# EAGLE design V6523_v2 (EAGLE 7.7.0)
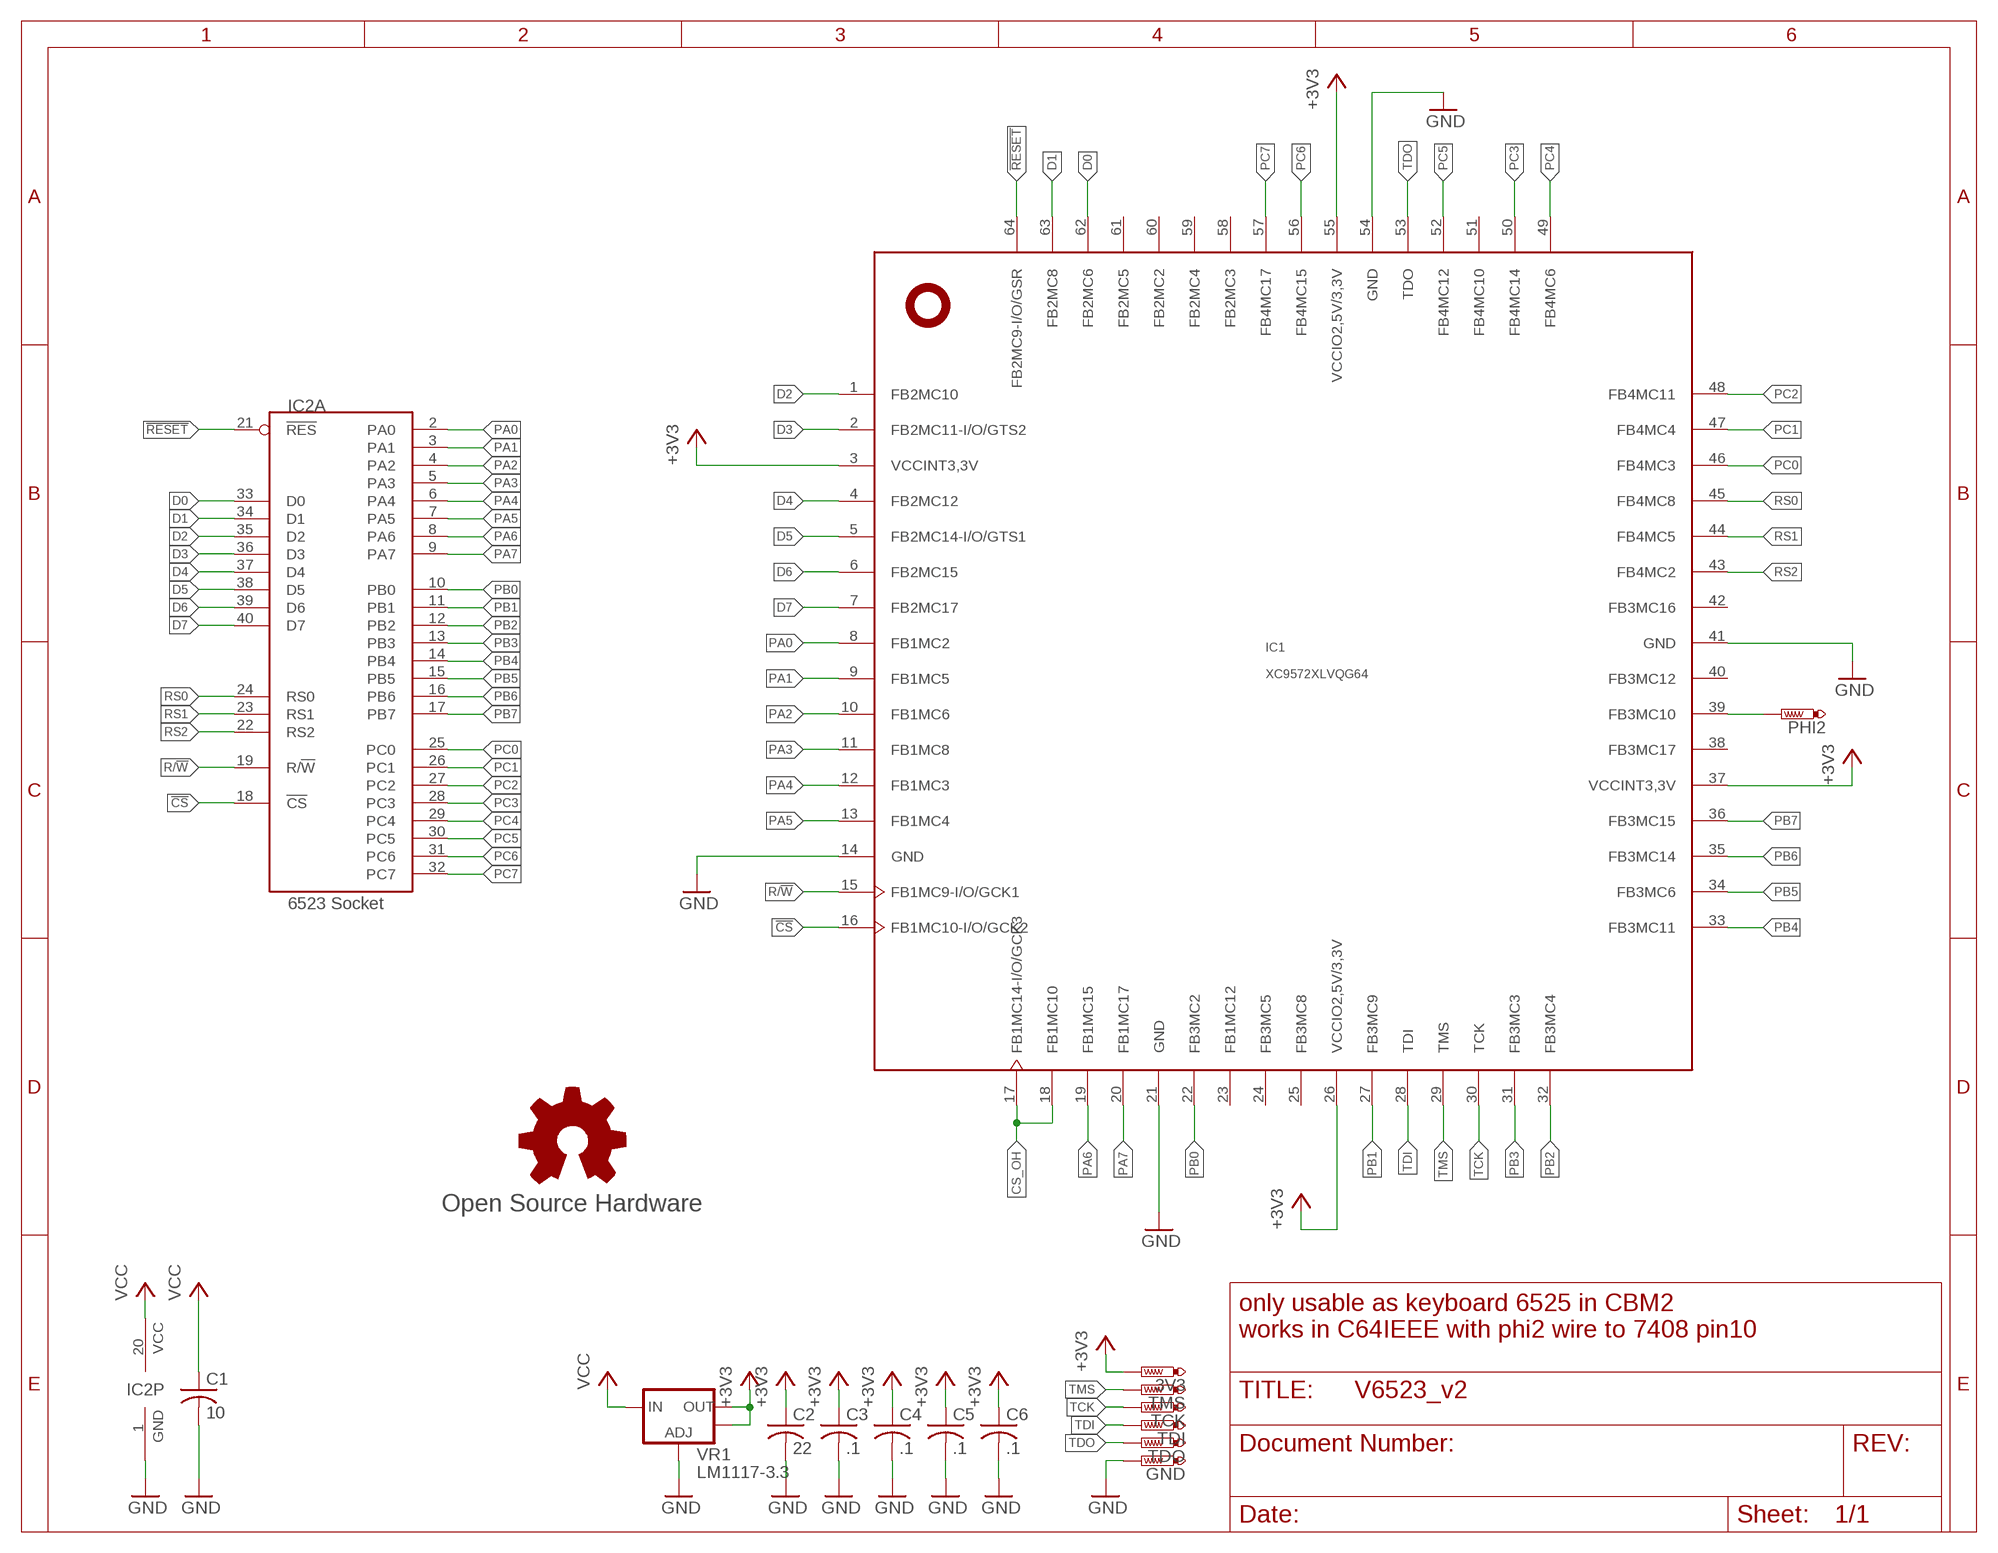
[diagram p0: schematic, sheet 1]

## Parts
3V3  PTR1TP08R  [TP08R]
C1  10  C-USC0805  [C0805]
C2  22  C-USC0805  [C0805]
C3  .1  C-USC0603  [C0603]
C4  .1  C-USC0603  [C0603]
C5  .1  C-USC0603  [C0603]
C6  .1  C-USC0603  [C0603]
GND  PTR1TP08R  [TP08R]
GOLD_ORB_SM1  Open Source Hardware  OSHWLOGOLOGO5MM  [OSHW_5MM]
IC1  XC9572XLVQG64  [VQFP64]
IC2  6523 Socket  6523NOFRAME  [DIL40-RP-NOFRAME]
PHI2  PTR1TP08R  [TP08R]
TCK  PTR1TP08R  [TP08R]
TDI  PTR1TP08R  [TP08R]
TDO  PTR1TP08R  [TP08R]
TMS  PTR1TP08R  [TP08R]
VR1  LM1117-3.3  V_REG_LM1117SOT223  [SOT223]

## Nets
!CS: IC1.16(FB1MC10-I/O/GCK2) IC2.18(A:!CS)
!RESET: IC1.64(FB2MC9-I/O/GSR) IC2.21(A:!RES)
+3V3: 3V3.TP C2.1 C3.1 C4.1 C5.1 C6.1 IC1.3(VCCINT3,3V) IC1.26(VCCIO2,5V/3,3V) IC1.37(VCCINT3,3V) IC1.55(VCCIO2,5V/3,3V) VR1.2(OUT) VR1.4(OUT)
CS_OH: IC1.17(FB1MC14-I/O/GCK3) IC1.18(FB1MC10)
D0: IC1.62(FB2MC6) IC2.33(A:D0)
D1: IC1.63(FB2MC8) IC2.34(A:D1)
D2: IC1.1(FB2MC10) IC2.35(A:D2)
D3: IC1.2(FB2MC11-I/O/GTS2) IC2.36(A:D3)
D4: IC1.4(FB2MC12) IC2.37(A:D4)
D5: IC1.5(FB2MC14-I/O/GTS1) IC2.38(A:D5)
D6: IC1.6(FB2MC15) IC2.39(A:D6)
D7: IC1.7(FB2MC17) IC2.40(A:D7)
GND: C1.2 C2.2 C3.2 C4.2 C5.2 C6.2 GND.TP IC1.14(GND) IC1.21(GND) IC1.41(GND) IC1.54(GND) IC2.1(P:GND) VR1.1(ADJ)
PA0: IC1.8(FB1MC2) IC2.2(A:PA0)
PA1: IC1.9(FB1MC5) IC2.3(A:PA1)
PA2: IC1.10(FB1MC6) IC2.4(A:PA2)
PA3: IC1.11(FB1MC8) IC2.5(A:PA3)
PA4: IC1.12(FB1MC3) IC2.6(A:PA4)
PA5: IC1.13(FB1MC4) IC2.7(A:PA5)
PA6: IC1.19(FB1MC15) IC2.8(A:PA6)
PA7: IC1.20(FB1MC17) IC2.9(A:PA7)
PB0: IC1.22(FB3MC2) IC2.10(A:PB0)
PB1: IC1.27(FB3MC9) IC2.11(A:PB1)
PB2: IC1.32(FB3MC4) IC2.12(A:PB2)
PB3: IC1.31(FB3MC3) IC2.13(A:PB3)
PB4: IC1.33(FB3MC11) IC2.14(A:PB4)
PB5: IC1.34(FB3MC6) IC2.15(A:PB5)
PB6: IC1.35(FB3MC14) IC2.16(A:PB6)
PB7: IC1.36(FB3MC15) IC2.17(A:PB7)
PC0: IC1.46(FB4MC3) IC2.25(A:PC0)
PC1: IC1.47(FB4MC4) IC2.26(A:PC1)
PC2: IC1.48(FB4MC11) IC2.27(A:PC2)
PC3: IC1.50(FB4MC14) IC2.28(A:PC3)
PC4: IC1.49(FB4MC6) IC2.29(A:PC4)
PC5: IC1.52(FB4MC12) IC2.30(A:PC5)
PC6: IC1.56(FB4MC15) IC2.31(A:PC6)
PC7: IC1.57(FB4MC17) IC2.32(A:PC7)
PHI2: IC1.39(FB3MC10) PHI2.TP
R/!W: IC1.15(FB1MC9-I/O/GCK1) IC2.19(A:R/!W)
RS0: IC1.45(FB4MC8) IC2.24(A:RS0)
RS1: IC1.44(FB4MC5) IC2.23(A:RS1)
RS2: IC1.43(FB4MC2) IC2.22(A:RS2)
TCK: IC1.30(TCK) TCK.TP
TDI: IC1.28(TDI) TDI.TP
TDO: IC1.53(TDO) TDO.TP
TMS: IC1.29(TMS) TMS.TP
VCC: C1.1 IC2.20(P:VCC) VR1.3(IN)
Unconnected: IC1.23(FB1MC12) IC1.24(FB3MC5) IC1.25(FB3MC8) IC1.38(FB3MC17) IC1.40(FB3MC12) IC1.42(FB3MC16) IC1.51(FB4MC10) IC1.58(FB2MC3) IC1.59(FB2MC4) IC1.60(FB2MC2) IC1.61(FB2MC5)

## Notes on the sheet
- only usable as keyboard 6525 in CBM2
  works in C64IEEE with phi2 wire to 7408 pin10

## Library data of the parts
3V3 GND PHI2 TCK TDI TDO TMS = testpad:PTR1: TEST PIN
C1-C6 = rcl:C-US: CAPACITOR, American symbol
GOLD_ORB_SM1 = oshw:OSHWLOGO: The OSHW logo for PCB layout
IC1 = xilinx_xc95XXXxl:XC9572XLVQG64
IC2 = commodore:6523
VR1 = SparkFun:V_REG_LM1117: Voltage Regulator LM1117 Standard adjustable voltage regulator but in SMD form. Spark Fun Electronics SKU : COM-00595

## Board
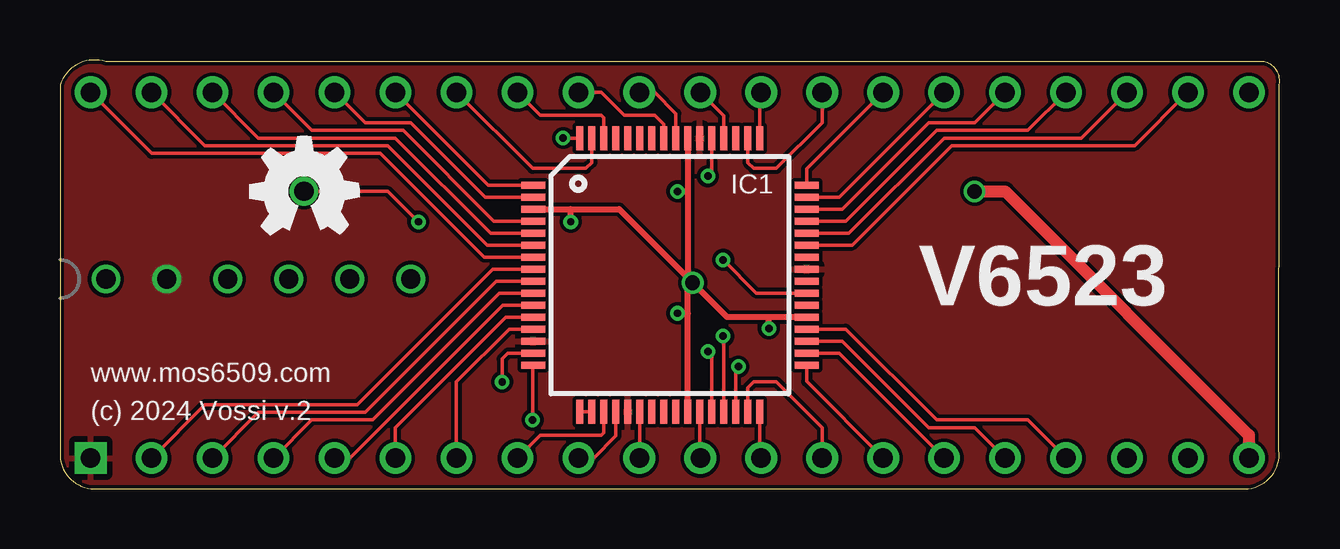
[diagram p1: board, top side]
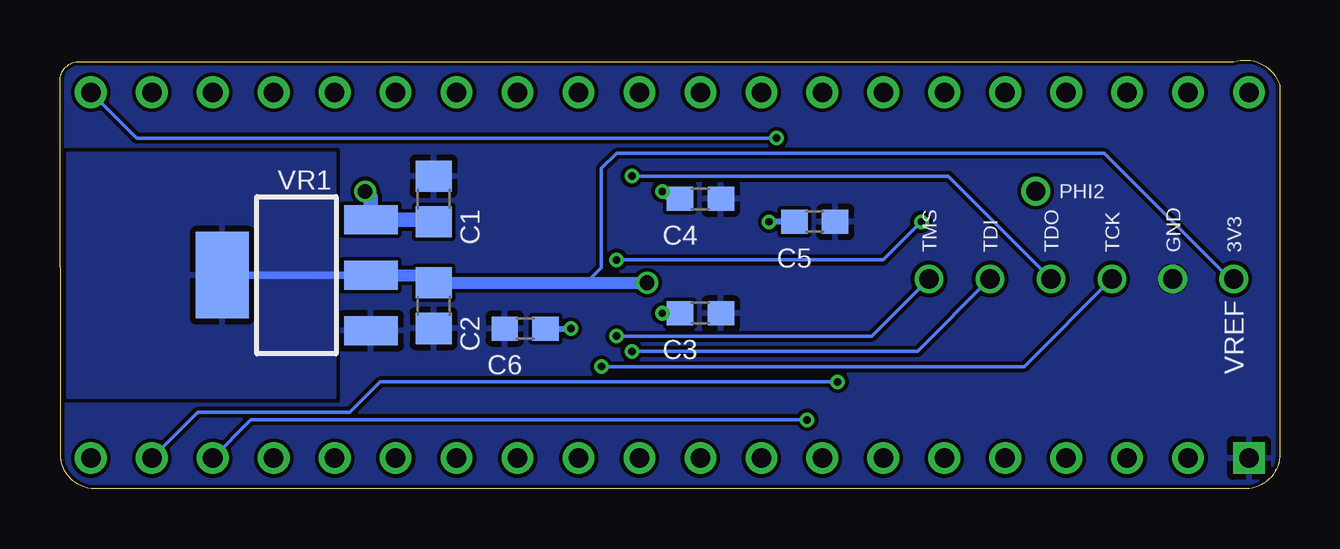
[diagram p2: board, bottom side, seen from below]

Size 50.82 x 17.86 mm. Coordinates in mm from the lower left corner, seen from the top.
Outline: 0.01,16.83 0.01,1.59 arc90 1.28,0 49.52,0 arc90 50.79,1.59 50.81,16.83 arc90 50.17,17.78 1.91,17.78 arc90 0.01,16.83
Copper layers (1*16): Top 0.035mm / dielectric 1.5mm / Bottom 0.035mm
Design rules "hackvana *": minimum track width 6mil, minimum drill 0.3mm, track to track 6mil, track to pad 6mil, pad to pad 6mil, via to via 6mil, smd to smd 0mil, copper to edge 6mil, drill to drill 6mil, minimum pad ring 10mil, minimum via ring 6mil, stop-mask expansion 2mil, vias tented up to drill 100mil, thermal gap 10mil

### Footprints (pad centres in the part's own frame; a part is rotated, then mirrored left to right if it is on the bottom)
TP08R = smd 0.8 x 0.8: TP 0,0
C0805 = smd 1.3 x 1.5: 1 -0.95,0; 2 0.95,0
C0603 = smd 1.1 x 1: 1 -0.85,0; 2 0.85,0
VQFP64 = smd 1 x 0.3: 1 -5.7,3.75; 2 -5.7,3.25; 3 -5.7,2.75; 4 -5.7,2.25; 5 -5.7,1.75; 6 -5.7,1.25; 7 -5.7,0.75; 8 -5.7,0.25; 9 -5.7,-0.25; 10 -5.7,-0.75; 11 -5.7,-1.25; 12 -5.7,-1.75; 13 -5.7,-2.25; 14 -5.7,-2.75; 15 -5.7,-3.25; 16 -5.7,-3.75; 33 5.7,-3.75; 34 5.7,-3.25; 35 5.7,-2.75; 36 5.7,-2.25; 37 5.7,-1.75; 38 5.7,-1.25; 39 5.7,-0.75; 40 5.7,-0.25; 41 5.7,0.25; 42 5.7,0.75; 43 5.7,1.25; 44 5.7,1.75; 45 5.7,2.25; 46 5.7,2.75; 47 5.7,3.25; 48 5.7,3.75 | smd 0.3 x 1: 17 -3.75,-5.7; 18 -3.25,-5.7; 19 -2.75,-5.7; 20 -2.25,-5.7; 21 -1.75,-5.7; 22 -1.25,-5.7; 23 -0.75,-5.7; 24 -0.25,-5.7; 25 0.25,-5.7; 26 0.75,-5.7; 27 1.25,-5.7; 28 1.75,-5.7; 29 2.25,-5.7; 30 2.75,-5.7; 31 3.25,-5.7; 32 3.75,-5.7; 49 3.75,5.7; 50 3.25,5.7; 51 2.75,5.7; 52 2.25,5.7; 53 1.75,5.7; 54 1.25,5.7; 55 0.75,5.7; 56 0.25,5.7; 57 -0.25,5.7; 58 -0.75,5.7; 59 -1.25,5.7; 60 -1.75,5.7; 61 -2.25,5.7; 62 -2.75,5.7; 63 -3.25,5.7; 64 -3.75,5.7
DIL40-RP-NOFRAME = drill 0.813 square: 1 -24.13,-7.62 | drill 0.813: 2 -21.59,-7.62; 3 -19.05,-7.62; 4 -16.51,-7.62; 5 -13.97,-7.62; 6 -11.43,-7.62; 7 -8.89,-7.62; 8 -6.35,-7.62; 9 -3.81,-7.62; 10 -1.27,-7.62; 11 1.27,-7.62; 12 3.81,-7.62; 13 6.35,-7.62; 14 8.89,-7.62; 15 11.43,-7.62; 16 13.97,-7.62; 17 16.51,-7.62; 18 19.05,-7.62; 19 21.59,-7.62; 20 24.13,-7.62; 21 24.13,7.62; 22 21.59,7.62; 23 19.05,7.62; 24 16.51,7.62; 25 13.97,7.62; 26 11.43,7.62; 27 8.89,7.62; 28 6.35,7.62; 29 3.81,7.62; 30 1.27,7.62; 31 -1.27,7.62; 32 -3.81,7.62; 33 -6.35,7.62; 34 -8.89,7.62; 35 -11.43,7.62; 36 -13.97,7.62; 37 -16.51,7.62; 38 -19.05,7.62; 39 -21.59,7.62; 40 -24.13,7.62
SOT223 = smd 1.219 x 2.235: 1 -2.311,-3.099; 2 0,-3.099; 3 2.311,-3.099 | smd 3.6 x 2.2: 4 0,3.099

### Placement (x,y rotation side)
3V3  1.91,8.73 270 bottom
C1  35.25,12.06 90 bottom
C2  35.25,7.62 270 bottom
C3  24.14,7.3 0 bottom
C4  24.14,12.06 0 bottom
C5  19.38,11.11 0 bottom
C6  31.44,6.67 180 bottom
GND  4.45,8.73 270 bottom
GOLD_ORB_SM1  10.17,12.38 0 top
IC1  25.41,8.89 0 top
IC2  25.41,8.89 0 top
PHI2  10.17,12.38 0 top
TCK  6.99,8.73 270 bottom
TDI  12.07,8.73 270 bottom
TDO  9.53,8.73 270 bottom
TMS  14.61,8.73 270 bottom
VR1  40.97,8.89 90 bottom

### Tracks (layer width: path | path; a pad name or v marks a point on that pad's centre or on a via)
!CS  (via drill 0.3)
  Top 0.152: v19.69,2.86 19.69,5.12 IC1.16
  Bottom 0.152: v19.69,2.86 42.87,2.86 IC2.18
!RESET  (via drill 0.3)
  Top 0.152: IC1.64 20.98,14.59 v20.96,14.61
  Bottom 0.152: v20.96,14.61 47.63,14.61 IC2.21
+3V3  (via drill 0.3, 0.61, 0.8)
  Top 0.254: IC1.55 26.16,12.38 | 26.16,12.38 26.16,8.57 | IC1.26 26.16,7.3 | 26.16,7.3 26.16,8.57 | 26.16,8.57 v26.36,8.57 | IC1.3 21.28,11.64 | 21.28,11.64 23.29,11.64 v26.36,8.57 | IC1.37 29.54,7.14 | 29.54,7.14 27.79,7.14 v26.36,8.57 | v21.28,11.11 21.28,11.64 | v25.73,12.38 26.16,12.38 | v25.73,7.3 26.16,7.3 | v29.54,6.67 29.54,7.14
  Bottom 0.152: 2.23,8.73 2.23,8.89 7.31,13.97 27.63,13.97 28.27,13.34 28.27,9.21 28.9,8.57
  Bottom 0.254: C5.1 v21.28,11.11 | C3.1 v25.73,7.3 | C6.1 v29.54,6.67
  Bottom 0.305: 3V3.TP 2.23,8.73 | 35.57,8.89 C2.1 | VR1.2 VR1.4 | C4.1 25.41,12.06 v25.73,12.38
  Bottom 0.508: VR1.2 35.57,8.89 | C2.1 28.9,8.57 27.32,8.57 27.31,8.57 v26.36,8.57 26.16,8.57
  other vias: 1.91,8.73
  pour Bottom: 39.38,3.81 50.49,3.81 50.49,13.97 39.38,13.97
CS_OH
  Top 0.152: IC1.17 IC1.18
D0
  Top 0.152: IC1.62 22.66,15.45 22.55,15.56 20.01,15.56 IC2.33
D1
  Top 0.152: IC1.63 22.16,13.58 21.92,13.34 19.69,13.34 IC2.34
D2
  Top 0.152: IC1.1 17.85,12.64 IC2.35
D3
  Top 0.152: IC2.36 12.71,15.24 14.61,15.24 17.71,12.14 IC1.2
D4
  Top 0.152: IC2.37 10.49,14.92 14.3,14.92 18.08,11.14 IC1.4
D5
  Top 0.152: IC2.38 8.26,14.61 13.98,14.61 17.94,10.64 IC1.5
D6
  Top 0.152: IC2.39 6.04,14.29 13.66,14.29 17.81,10.14 IC1.6
D7
  Top 0.152: IC2.40 3.82,13.97 13.34,13.97 17.67,9.64 IC1.7
GND  (via drill 0.8)
  other vias: 4.45,8.73
  pour Top (rank 2): 1.91,17.78 50.49,17.78 arc-90 50.81,16.51 50.81,1.59 arc-90 49.54,0 1.28,0 arc-90 0.01,1.59 0.01,16.51 arc-90
  pour Bottom (rank 2): 1.91,17.78 50.17,17.78 arc-90 50.81,16.83 50.81,1.59 arc-90 49.54,0 1.28,0 arc-90 0.01,1.59 0.01,16.51 arc-90
PA0
  Top 0.152: IC2.2 6.04,3.49 12.39,3.49 18.04,9.14 IC1.8
PA1
  Top 0.152: IC2.3 8.26,3.17 12.71,3.17 18.17,8.64 IC1.9
PA2
  Top 0.152: IC2.4 10.49,2.86 13.03,2.86 18.31,8.14 IC1.10
PA3
  Top 0.152: IC1.11 18.44,7.64 12.07,1.27 IC2.5
PA4
  Top 0.152: IC2.6 13.98,2.54 18.58,7.14 IC1.12
PA5
  Top 0.152: IC1.13 18.71,6.64 16.52,4.45 IC2.7
PA6
  Top 0.152: IC1.19 22.66,2.33 22.55,2.22 20.01,2.22 IC2.8
PA7
  Top 0.152: IC1.20 23.16,2.19 22.23,1.27 IC2.9
PB0
  Top 0.152: IC1.22 24.16,1.29 IC2.10
PB1
  Top 0.152: IC1.27 26.66,1.29 IC2.11
PB2
  Top 0.152: IC1.32 29.16,1.33 IC2.12
PB3
  Top 0.152: IC1.31 28.66,4.2 28.9,4.45 29.85,4.45 31.76,2.54 IC2.13
PB4
  Top 0.152: IC1.33 31.11,4.46 IC2.14
PB5
  Top 0.152: IC1.34 32.47,5.64 IC2.15
PB6
  Top 0.152: IC1.35 32.6,6.14 36.2,2.54 38.11,2.54 IC2.16
PB7
  Top 0.152: IC1.36 32.74,6.64 36.52,2.86 40.33,2.86 IC2.17
PC0
  Top 0.152: IC1.46 32.6,11.64 36.2,15.24 38.11,15.24 IC2.25
PC1
  Top 0.152: IC1.47 32.47,12.14 IC2.26
PC2
  Top 0.152: IC1.48 31.11,13.32 IC2.27
PC3
  Top 0.152: IC1.50 28.66,13.58 28.9,13.34 29.85,13.34 31.76,15.24 IC2.28
PC4
  Top 0.152: IC1.49 29.16,16.45 IC2.29
PC5
  Top 0.152: IC1.52 27.66,15.53 IC2.30
PC6
  Top 0.152: IC1.56 25.66,15.62 24.77,16.51 IC2.31
PC7
  Top 0.152: IC1.57 25.16,15.17 24.77,15.56 23.5,15.56 22.55,16.51 IC2.32
PHI2  (via drill 0.3, 0.8)
  Top 0.152: IC1.39 29.02,8.14 v27.63,9.53 | v14.93,11.11 13.66,12.38 PHI2.TP
  Bottom 0.152: v27.63,9.53 16.52,9.53 v14.93,11.11
  other vias: 10.17,12.38
R/!W  (via drill 0.3)
  Top 0.152: IC1.15 18.67,5.64 18.42,5.4 v18.42,4.45
  Bottom 0.152: v18.42,4.45 37.47,4.45 38.74,3.17 45.09,3.17 IC2.19
RS0
  Top 0.152: IC2.24 40.33,14.92 36.52,14.92 32.74,11.14 IC1.45
RS1
  Top 0.152: IC2.23 42.55,14.61 36.84,14.61 32.87,10.64 IC1.44
RS2
  Top 0.152: IC2.22 44.78,14.29 37.16,14.29 33.01,10.14 IC1.43
TCK  (via drill 0.3, 0.8)
  Top 0.152: IC1.30 28.16,4.97 v28.27,5.08
  Bottom 0.152: v28.27,5.08 10.64,5.08 TCK.TP
  other vias: 6.99,8.73
TDI  (via drill 0.3, 0.8)
  Top 0.152: IC1.28 27.16,5.55 v27,5.71
  Bottom 0.152: v27,5.71 15.09,5.71 TDI.TP
  other vias: 12.07,8.73
TDO  (via drill 0.3, 0.8)
  Top 0.152: IC1.53 27.16,13.18 v27,13.02
  Bottom 0.152: v27,13.02 13.82,13.02 TDO.TP
  other vias: 9.53,8.73
TMS  (via drill 0.3, 0.8)
  Top 0.152: IC1.29 27.66,6.32 v27.63,6.35
  Bottom 0.152: v27.63,6.35 16.99,6.35 TMS.TP
  other vias: 14.61,8.73
VCC  (via drill 0.6)
  Top 0.508: IC2.20 49.54,2.22 39.38,12.38 v38.11,12.38
  Bottom 0.61: C1.1 35.34,11.2 VR1.3 37.87,12.14 v38.11,12.38

### Text on the board
tNames: V6523 | www.mos6509.com | (c) 2024 Vossi v.2
bNames: VREF
bDocu: JLCJLCJLCJLC